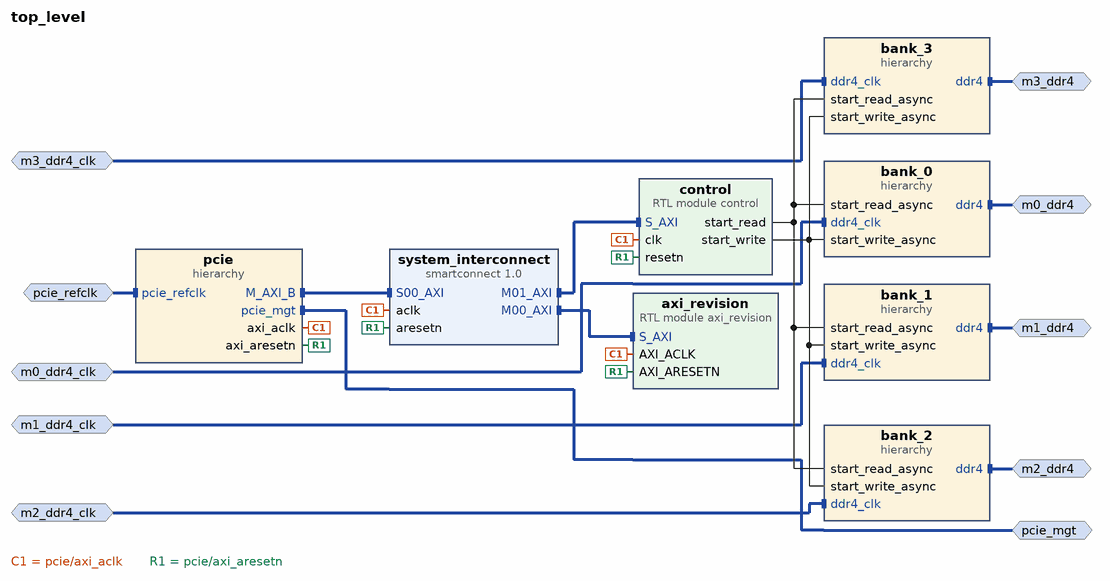
[diagram p0: block diagram of the top level]
# Vivado block design top_level, xcvu9p-flgb2104-3-e, Vivado 2021.1
create_bd_design top_level

create_bd_intf_port -mode Slave -vlnv xilinx.com:interface:diff_clock_rtl:1.0 pcie_refclk
create_bd_intf_port -mode Master -vlnv xilinx.com:interface:pcie_7x_mgt_rtl:1.0 pcie_mgt
create_bd_intf_port -mode Slave -vlnv xilinx.com:interface:diff_clock_rtl:1.0 m0_ddr4_clk
create_bd_intf_port -mode Master -vlnv xilinx.com:interface:ddr4_rtl:1.0 m0_ddr4
create_bd_intf_port -mode Master -vlnv xilinx.com:interface:ddr4_rtl:1.0 m1_ddr4
create_bd_intf_port -mode Master -vlnv xilinx.com:interface:ddr4_rtl:1.0 m2_ddr4
create_bd_intf_port -mode Master -vlnv xilinx.com:interface:ddr4_rtl:1.0 m3_ddr4
create_bd_intf_port -mode Slave -vlnv xilinx.com:interface:diff_clock_rtl:1.0 m1_ddr4_clk
create_bd_intf_port -mode Slave -vlnv xilinx.com:interface:diff_clock_rtl:1.0 m2_ddr4_clk
create_bd_intf_port -mode Slave -vlnv xilinx.com:interface:diff_clock_rtl:1.0 m3_ddr4_clk

create_bd_cell -type hier pcie
create_bd_cell -type module -reference axi_revision axi_revision
create_bd_cell -type ip -vlnv xilinx.com:ip:smartconnect:1.0 system_interconnect
set_property -dict {CONFIG.NUM_MI 2 CONFIG.NUM_SI 1} [get_bd_cells system_interconnect]
create_bd_cell -type hier bank_0
create_bd_cell -type module -reference control control
create_bd_cell -type hier bank_1
create_bd_cell -type hier bank_2
create_bd_cell -type hier bank_3

# ---- hierarchy /pcie ----
current_bd_instance /pcie
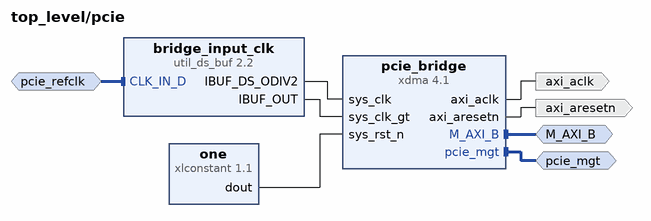
[diagram p1: block diagram inside /pcie]
create_bd_intf_pin -mode Master -vlnv xilinx.com:interface:pcie_7x_mgt_rtl:1.0 pcie_mgt
create_bd_intf_pin -mode Slave -vlnv xilinx.com:interface:diff_clock_rtl:1.0 pcie_refclk
create_bd_intf_pin -mode Master -vlnv xilinx.com:interface:aximm_rtl:1.0 M_AXI_B
create_bd_pin -dir O -type clk axi_aclk
create_bd_pin -dir O -type rst axi_aresetn

create_bd_cell -type ip -vlnv xilinx.com:ip:util_ds_buf:2.2 bridge_input_clk
set_property -dict {CONFIG.C_BUF_TYPE IBUFDSGTE} [get_bd_cells bridge_input_clk]
create_bd_cell -type ip -vlnv xilinx.com:ip:xdma:4.1 pcie_bridge
set_property -dict [list \
  CONFIG.PF0_DEVICE_ID_mqdma 903F \
  CONFIG.PF0_SRIOV_VF_DEVICE_ID A03F \
  CONFIG.PF2_DEVICE_ID_mqdma 923F \
  CONFIG.PF3_DEVICE_ID_mqdma 933F \
  CONFIG.axi_addr_width 64 \
  CONFIG.axi_data_width 512_bit \
  CONFIG.axisten_freq 250 \
  CONFIG.bridge_burst true \
  CONFIG.en_axi_master_if true \
  CONFIG.en_axi_slave_if true \
  CONFIG.functional_mode AXI_Bridge \
  CONFIG.mode_selection Advanced \
  CONFIG.pcie_blk_locn X1Y2 \
  CONFIG.pf0_bar0_scale Megabytes \
  CONFIG.pf0_bar0_size 1 \
  CONFIG.pf0_bar1_enabled true \
  CONFIG.pf0_bar1_scale Megabytes \
  CONFIG.pf0_bar1_size 1 \
  CONFIG.pf0_device_id 903F \
  CONFIG.pl_link_cap_max_link_speed 8.0_GT/s \
  CONFIG.pl_link_cap_max_link_width X16 \
  CONFIG.plltype QPLL1 \
] [get_bd_cells pcie_bridge]
create_bd_cell -type ip -vlnv xilinx.com:ip:xlconstant:1.1 one

# ---- hierarchy /bank_0 ----
current_bd_instance /bank_0
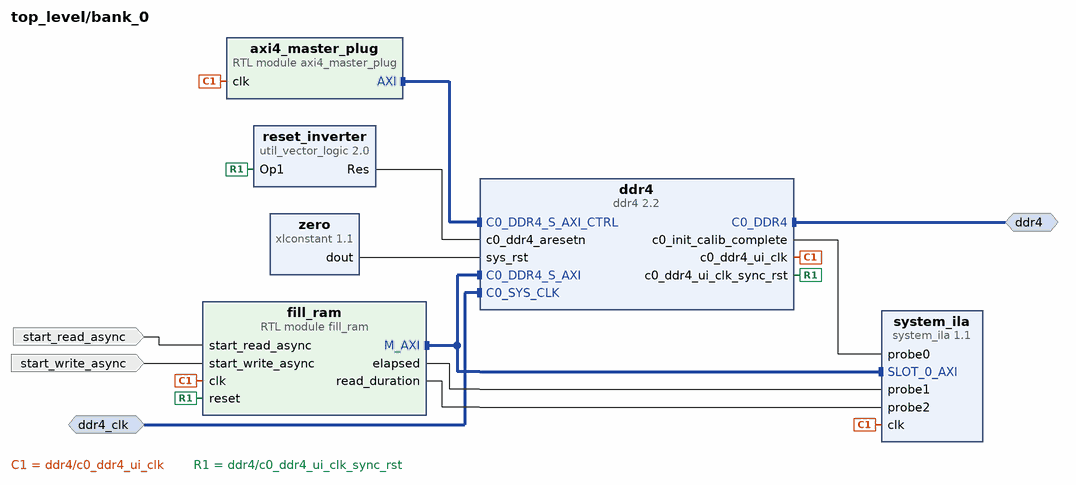
[diagram p2: block diagram inside /bank_0]
create_bd_intf_pin -mode Slave -vlnv xilinx.com:interface:diff_clock_rtl:1.0 ddr4_clk
create_bd_intf_pin -mode Master -vlnv xilinx.com:interface:ddr4_rtl:1.0 ddr4
create_bd_pin -dir I start_write_async
create_bd_pin -dir I start_read_async

create_bd_cell -type module -reference axi4_master_plug axi4_master_plug
create_bd_cell -type ip -vlnv xilinx.com:ip:system_ila:1.1 system_ila
set_property -dict {CONFIG.C_DATA_DEPTH 2048 CONFIG.C_MON_TYPE MIX CONFIG.C_NUM_OF_PROBES 3} [get_bd_cells system_ila]
create_bd_cell -type ip -vlnv xilinx.com:ip:xlconstant:1.1 zero
set_property -dict {CONFIG.CONST_VAL 0} [get_bd_cells zero]
create_bd_cell -type ip -vlnv xilinx.com:ip:util_vector_logic:2.0 reset_inverter
set_property -dict {CONFIG.C_OPERATION not CONFIG.C_SIZE 1} [get_bd_cells reset_inverter]
create_bd_cell -type ip -vlnv xilinx.com:ip:ddr4:2.2 ddr4
set_property -dict [list \
  CONFIG.C0.DDR4_AxiAddressWidth 34 \
  CONFIG.C0.DDR4_AxiDataWidth 512 \
  CONFIG.C0.DDR4_CasWriteLatency 16 \
  CONFIG.C0.DDR4_CustomParts ../../../../../../ddr/MTA18ADF2G72PZ-2G3.csv \
  CONFIG.C0.DDR4_DataWidth 72 \
  CONFIG.C0.DDR4_EN_PARITY true \
  CONFIG.C0.DDR4_InputClockPeriod 9996 \
  CONFIG.C0.DDR4_MemoryPart MTA18ADF2G72PZ-2G3 \
  CONFIG.C0.DDR4_MemoryType RDIMMs \
  CONFIG.C0.DDR4_TimePeriod 833 \
  CONFIG.C0.DDR4_isCustom true \
] [get_bd_cells ddr4]
create_bd_cell -type module -reference fill_ram fill_ram

# ---- hierarchy /bank_1 ----
current_bd_instance /bank_1
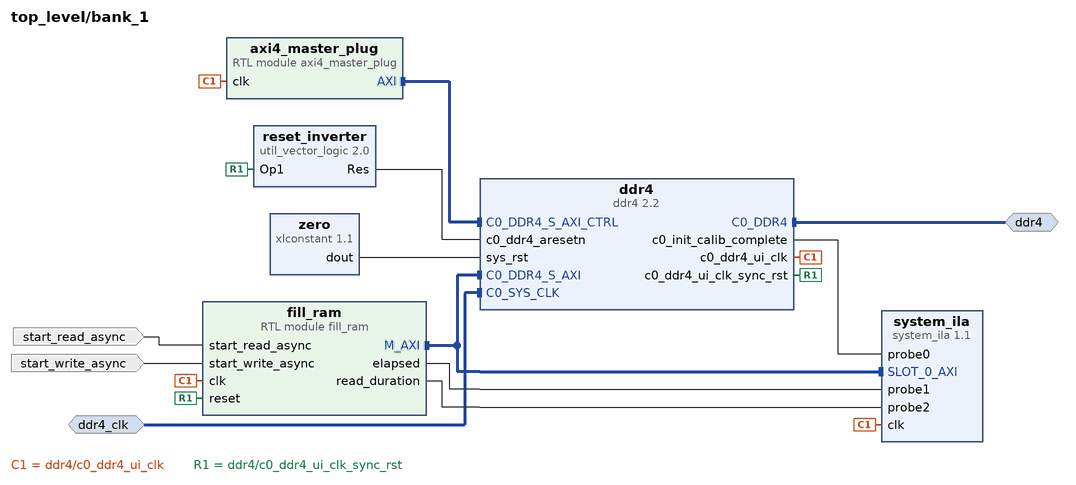
[diagram p3: block diagram inside /bank_1]
create_bd_intf_pin -mode Slave -vlnv xilinx.com:interface:diff_clock_rtl:1.0 ddr4_clk
create_bd_intf_pin -mode Master -vlnv xilinx.com:interface:ddr4_rtl:1.0 ddr4
create_bd_pin -dir I start_write_async
create_bd_pin -dir I start_read_async

create_bd_cell -type module -reference axi4_master_plug axi4_master_plug
create_bd_cell -type ip -vlnv xilinx.com:ip:system_ila:1.1 system_ila
set_property -dict {CONFIG.C_DATA_DEPTH 2048 CONFIG.C_MON_TYPE MIX CONFIG.C_NUM_OF_PROBES 3} [get_bd_cells system_ila]
create_bd_cell -type ip -vlnv xilinx.com:ip:xlconstant:1.1 zero
set_property -dict {CONFIG.CONST_VAL 0} [get_bd_cells zero]
create_bd_cell -type ip -vlnv xilinx.com:ip:util_vector_logic:2.0 reset_inverter
set_property -dict {CONFIG.C_OPERATION not CONFIG.C_SIZE 1} [get_bd_cells reset_inverter]
create_bd_cell -type ip -vlnv xilinx.com:ip:ddr4:2.2 ddr4
set_property -dict [list \
  CONFIG.C0.DDR4_AxiAddressWidth 34 \
  CONFIG.C0.DDR4_AxiDataWidth 512 \
  CONFIG.C0.DDR4_CasWriteLatency 16 \
  CONFIG.C0.DDR4_CustomParts ../../../../../../ddr/MTA18ADF2G72PZ-2G3.csv \
  CONFIG.C0.DDR4_DataWidth 72 \
  CONFIG.C0.DDR4_EN_PARITY true \
  CONFIG.C0.DDR4_InputClockPeriod 9996 \
  CONFIG.C0.DDR4_MemoryPart MTA18ADF2G72PZ-2G3 \
  CONFIG.C0.DDR4_MemoryType RDIMMs \
  CONFIG.C0.DDR4_TimePeriod 833 \
  CONFIG.C0.DDR4_isCustom true \
] [get_bd_cells ddr4]
create_bd_cell -type module -reference fill_ram fill_ram
set_property -dict {CONFIG.CHANNEL 1} [get_bd_cells fill_ram]

# ---- hierarchy /bank_2 ----
current_bd_instance /bank_2
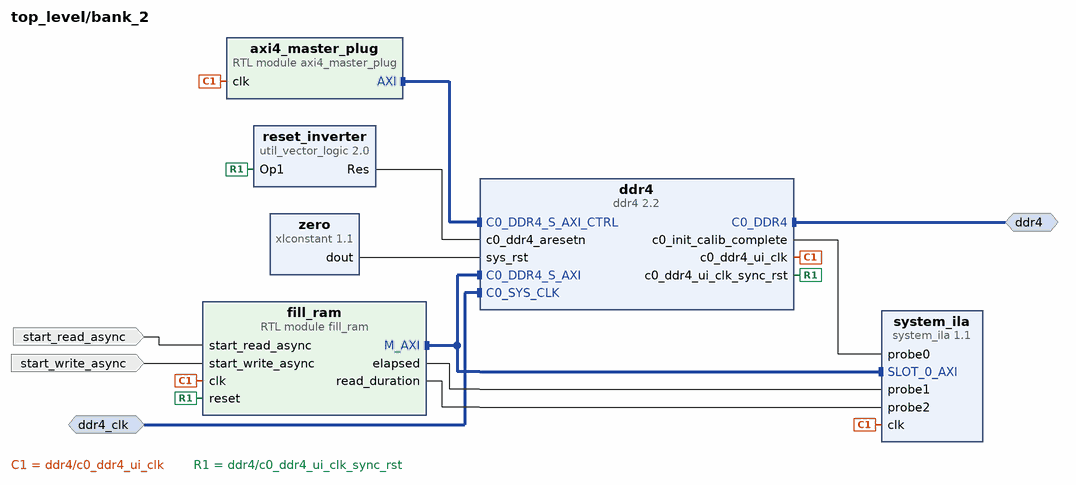
[diagram p4: block diagram inside /bank_2]
create_bd_intf_pin -mode Slave -vlnv xilinx.com:interface:diff_clock_rtl:1.0 ddr4_clk
create_bd_intf_pin -mode Master -vlnv xilinx.com:interface:ddr4_rtl:1.0 ddr4
create_bd_pin -dir I start_write_async
create_bd_pin -dir I start_read_async

create_bd_cell -type module -reference axi4_master_plug axi4_master_plug
create_bd_cell -type ip -vlnv xilinx.com:ip:system_ila:1.1 system_ila
set_property -dict {CONFIG.C_DATA_DEPTH 2048 CONFIG.C_MON_TYPE MIX CONFIG.C_NUM_OF_PROBES 3} [get_bd_cells system_ila]
create_bd_cell -type ip -vlnv xilinx.com:ip:xlconstant:1.1 zero
set_property -dict {CONFIG.CONST_VAL 0} [get_bd_cells zero]
create_bd_cell -type ip -vlnv xilinx.com:ip:util_vector_logic:2.0 reset_inverter
set_property -dict {CONFIG.C_OPERATION not CONFIG.C_SIZE 1} [get_bd_cells reset_inverter]
create_bd_cell -type ip -vlnv xilinx.com:ip:ddr4:2.2 ddr4
set_property -dict [list \
  CONFIG.C0.DDR4_AxiAddressWidth 34 \
  CONFIG.C0.DDR4_AxiDataWidth 512 \
  CONFIG.C0.DDR4_CasWriteLatency 16 \
  CONFIG.C0.DDR4_CustomParts ../../../../../../ddr/MTA18ADF2G72PZ-2G3.csv \
  CONFIG.C0.DDR4_DataWidth 72 \
  CONFIG.C0.DDR4_EN_PARITY true \
  CONFIG.C0.DDR4_InputClockPeriod 9996 \
  CONFIG.C0.DDR4_MemoryPart MTA18ADF2G72PZ-2G3 \
  CONFIG.C0.DDR4_MemoryType RDIMMs \
  CONFIG.C0.DDR4_TimePeriod 833 \
  CONFIG.C0.DDR4_isCustom true \
] [get_bd_cells ddr4]
create_bd_cell -type module -reference fill_ram fill_ram
set_property -dict {CONFIG.CHANNEL 3} [get_bd_cells fill_ram]

# ---- hierarchy /bank_3 ----
current_bd_instance /bank_3
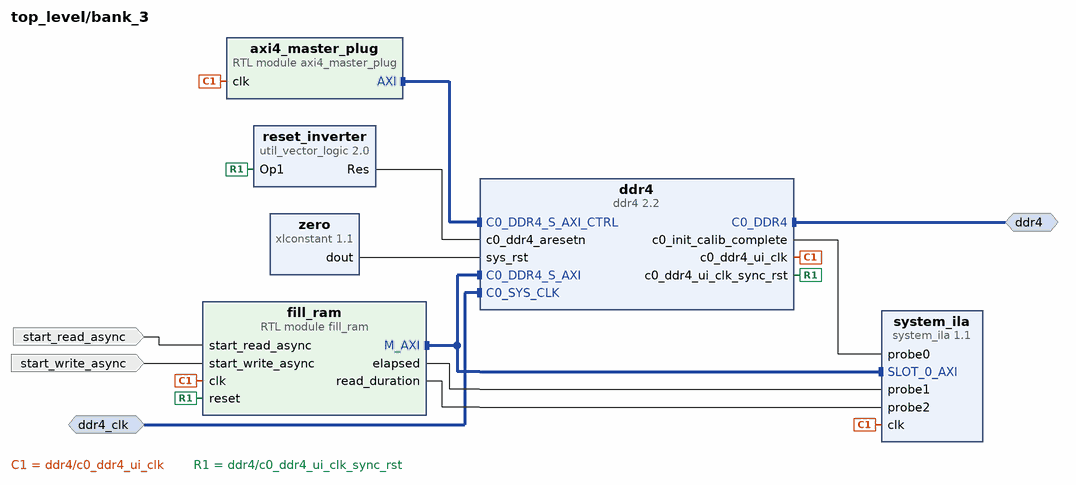
[diagram p5: block diagram inside /bank_3]
create_bd_intf_pin -mode Slave -vlnv xilinx.com:interface:diff_clock_rtl:1.0 ddr4_clk
create_bd_intf_pin -mode Master -vlnv xilinx.com:interface:ddr4_rtl:1.0 ddr4
create_bd_pin -dir I start_write_async
create_bd_pin -dir I start_read_async

create_bd_cell -type module -reference axi4_master_plug axi4_master_plug
create_bd_cell -type ip -vlnv xilinx.com:ip:system_ila:1.1 system_ila
set_property -dict {CONFIG.C_DATA_DEPTH 2048 CONFIG.C_MON_TYPE MIX CONFIG.C_NUM_OF_PROBES 3} [get_bd_cells system_ila]
create_bd_cell -type ip -vlnv xilinx.com:ip:xlconstant:1.1 zero
set_property -dict {CONFIG.CONST_VAL 0} [get_bd_cells zero]
create_bd_cell -type ip -vlnv xilinx.com:ip:util_vector_logic:2.0 reset_inverter
set_property -dict {CONFIG.C_OPERATION not CONFIG.C_SIZE 1} [get_bd_cells reset_inverter]
create_bd_cell -type ip -vlnv xilinx.com:ip:ddr4:2.2 ddr4
set_property -dict [list \
  CONFIG.C0.DDR4_AxiAddressWidth 34 \
  CONFIG.C0.DDR4_AxiDataWidth 512 \
  CONFIG.C0.DDR4_CasWriteLatency 16 \
  CONFIG.C0.DDR4_CustomParts ../../../../../../ddr/MTA18ADF2G72PZ-2G3.csv \
  CONFIG.C0.DDR4_DataWidth 72 \
  CONFIG.C0.DDR4_EN_PARITY true \
  CONFIG.C0.DDR4_InputClockPeriod 9996 \
  CONFIG.C0.DDR4_MemoryPart MTA18ADF2G72PZ-2G3 \
  CONFIG.C0.DDR4_MemoryType RDIMMs \
  CONFIG.C0.DDR4_TimePeriod 833 \
  CONFIG.C0.DDR4_isCustom true \
] [get_bd_cells ddr4]
create_bd_cell -type module -reference fill_ram fill_ram
set_property -dict {CONFIG.CHANNEL 3} [get_bd_cells fill_ram]

# ---- connections ----

current_bd_instance /pcie
connect_bd_intf_net [get_bd_intf_pins pcie_refclk] [get_bd_intf_pins bridge_input_clk/CLK_IN_D]
connect_bd_intf_net [get_bd_intf_pins M_AXI_B] [get_bd_intf_pins pcie_bridge/M_AXI_B]
connect_bd_intf_net [get_bd_intf_pins pcie_mgt] [get_bd_intf_pins pcie_bridge/pcie_mgt]
connect_bd_net [get_bd_pins one/dout] [get_bd_pins pcie_bridge/sys_rst_n]
connect_bd_net [get_bd_pins pcie_bridge/axi_aclk] [get_bd_pins axi_aclk]
connect_bd_net [get_bd_pins pcie_bridge/axi_aresetn] [get_bd_pins axi_aresetn]
connect_bd_net -net util_ds_buf_0_IBUF_DS_ODIV2 [get_bd_pins bridge_input_clk/IBUF_DS_ODIV2] [get_bd_pins pcie_bridge/sys_clk]
connect_bd_net -net util_ds_buf_0_IBUF_OUT [get_bd_pins bridge_input_clk/IBUF_OUT] [get_bd_pins pcie_bridge/sys_clk_gt]

current_bd_instance /bank_0
connect_bd_intf_net [get_bd_intf_pins ddr4_clk] [get_bd_intf_pins ddr4/C0_SYS_CLK]
connect_bd_intf_net [get_bd_intf_pins axi4_master_plug/AXI] [get_bd_intf_pins ddr4/C0_DDR4_S_AXI_CTRL]
connect_bd_intf_net [get_bd_intf_pins ddr4] [get_bd_intf_pins ddr4/C0_DDR4]
connect_bd_intf_net [get_bd_intf_pins fill_ram/M_AXI] [get_bd_intf_pins ddr4/C0_DDR4_S_AXI]
connect_bd_intf_net [get_bd_intf_pins fill_ram/M_AXI] [get_bd_intf_pins system_ila/SLOT_0_AXI]
connect_bd_net -net ddr4_0_c0_ddr4_ui_clk [get_bd_pins ddr4/c0_ddr4_ui_clk] \
  [get_bd_pins system_ila/clk] [get_bd_pins axi4_master_plug/clk] [get_bd_pins fill_ram/clk]
connect_bd_net -net ddr4_0_c0_ddr4_ui_clk_sync_rst [get_bd_pins ddr4/c0_ddr4_ui_clk_sync_rst] \
  [get_bd_pins reset_inverter/Op1] [get_bd_pins fill_ram/reset]
connect_bd_net -net ddr4_0_c0_init_calib_complete [get_bd_pins ddr4/c0_init_calib_complete] [get_bd_pins system_ila/probe0]
connect_bd_net -net fill_ram_0_elapsed [get_bd_pins fill_ram/elapsed] [get_bd_pins system_ila/probe1]
connect_bd_net [get_bd_pins fill_ram/read_duration] [get_bd_pins system_ila/probe2]
connect_bd_net [get_bd_pins reset_inverter/Res] [get_bd_pins ddr4/c0_ddr4_aresetn]
connect_bd_net [get_bd_pins start_read_async] [get_bd_pins fill_ram/start_read_async]
connect_bd_net [get_bd_pins start_write_async] [get_bd_pins fill_ram/start_write_async]
connect_bd_net [get_bd_pins zero/dout] [get_bd_pins ddr4/sys_rst]

current_bd_instance /bank_1
connect_bd_intf_net [get_bd_intf_pins ddr4_clk] [get_bd_intf_pins ddr4/C0_SYS_CLK]
connect_bd_intf_net [get_bd_intf_pins axi4_master_plug/AXI] [get_bd_intf_pins ddr4/C0_DDR4_S_AXI_CTRL]
connect_bd_intf_net [get_bd_intf_pins ddr4] [get_bd_intf_pins ddr4/C0_DDR4]
connect_bd_intf_net [get_bd_intf_pins fill_ram/M_AXI] [get_bd_intf_pins ddr4/C0_DDR4_S_AXI]
connect_bd_intf_net [get_bd_intf_pins fill_ram/M_AXI] [get_bd_intf_pins system_ila/SLOT_0_AXI]
connect_bd_net -net ddr4_0_c0_ddr4_ui_clk [get_bd_pins ddr4/c0_ddr4_ui_clk] \
  [get_bd_pins system_ila/clk] [get_bd_pins axi4_master_plug/clk] [get_bd_pins fill_ram/clk]
connect_bd_net -net ddr4_0_c0_ddr4_ui_clk_sync_rst [get_bd_pins ddr4/c0_ddr4_ui_clk_sync_rst] \
  [get_bd_pins reset_inverter/Op1] [get_bd_pins fill_ram/reset]
connect_bd_net -net ddr4_0_c0_init_calib_complete [get_bd_pins ddr4/c0_init_calib_complete] [get_bd_pins system_ila/probe0]
connect_bd_net -net fill_ram_0_elapsed [get_bd_pins fill_ram/elapsed] [get_bd_pins system_ila/probe1]
connect_bd_net [get_bd_pins fill_ram/read_duration] [get_bd_pins system_ila/probe2]
connect_bd_net [get_bd_pins reset_inverter/Res] [get_bd_pins ddr4/c0_ddr4_aresetn]
connect_bd_net [get_bd_pins start_read_async] [get_bd_pins fill_ram/start_read_async]
connect_bd_net [get_bd_pins start_write_async] [get_bd_pins fill_ram/start_write_async]
connect_bd_net [get_bd_pins zero/dout] [get_bd_pins ddr4/sys_rst]

current_bd_instance /bank_2
connect_bd_intf_net [get_bd_intf_pins ddr4_clk] [get_bd_intf_pins ddr4/C0_SYS_CLK]
connect_bd_intf_net [get_bd_intf_pins axi4_master_plug/AXI] [get_bd_intf_pins ddr4/C0_DDR4_S_AXI_CTRL]
connect_bd_intf_net [get_bd_intf_pins ddr4] [get_bd_intf_pins ddr4/C0_DDR4]
connect_bd_intf_net [get_bd_intf_pins fill_ram/M_AXI] [get_bd_intf_pins ddr4/C0_DDR4_S_AXI]
connect_bd_intf_net [get_bd_intf_pins fill_ram/M_AXI] [get_bd_intf_pins system_ila/SLOT_0_AXI]
connect_bd_net -net ddr4_0_c0_ddr4_ui_clk [get_bd_pins ddr4/c0_ddr4_ui_clk] \
  [get_bd_pins system_ila/clk] [get_bd_pins axi4_master_plug/clk] [get_bd_pins fill_ram/clk]
connect_bd_net -net ddr4_0_c0_ddr4_ui_clk_sync_rst [get_bd_pins ddr4/c0_ddr4_ui_clk_sync_rst] \
  [get_bd_pins reset_inverter/Op1] [get_bd_pins fill_ram/reset]
connect_bd_net -net ddr4_0_c0_init_calib_complete [get_bd_pins ddr4/c0_init_calib_complete] [get_bd_pins system_ila/probe0]
connect_bd_net -net fill_ram_0_elapsed [get_bd_pins fill_ram/elapsed] [get_bd_pins system_ila/probe1]
connect_bd_net [get_bd_pins fill_ram/read_duration] [get_bd_pins system_ila/probe2]
connect_bd_net [get_bd_pins reset_inverter/Res] [get_bd_pins ddr4/c0_ddr4_aresetn]
connect_bd_net [get_bd_pins start_read_async] [get_bd_pins fill_ram/start_read_async]
connect_bd_net [get_bd_pins start_write_async] [get_bd_pins fill_ram/start_write_async]
connect_bd_net [get_bd_pins zero/dout] [get_bd_pins ddr4/sys_rst]

current_bd_instance /bank_3
connect_bd_intf_net [get_bd_intf_pins ddr4_clk] [get_bd_intf_pins ddr4/C0_SYS_CLK]
connect_bd_intf_net [get_bd_intf_pins axi4_master_plug/AXI] [get_bd_intf_pins ddr4/C0_DDR4_S_AXI_CTRL]
connect_bd_intf_net [get_bd_intf_pins ddr4] [get_bd_intf_pins ddr4/C0_DDR4]
connect_bd_intf_net [get_bd_intf_pins fill_ram/M_AXI] [get_bd_intf_pins ddr4/C0_DDR4_S_AXI]
connect_bd_intf_net [get_bd_intf_pins fill_ram/M_AXI] [get_bd_intf_pins system_ila/SLOT_0_AXI]
connect_bd_net -net ddr4_0_c0_ddr4_ui_clk [get_bd_pins ddr4/c0_ddr4_ui_clk] \
  [get_bd_pins system_ila/clk] [get_bd_pins axi4_master_plug/clk] [get_bd_pins fill_ram/clk]
connect_bd_net -net ddr4_0_c0_ddr4_ui_clk_sync_rst [get_bd_pins ddr4/c0_ddr4_ui_clk_sync_rst] \
  [get_bd_pins reset_inverter/Op1] [get_bd_pins fill_ram/reset]
connect_bd_net -net ddr4_0_c0_init_calib_complete [get_bd_pins ddr4/c0_init_calib_complete] [get_bd_pins system_ila/probe0]
connect_bd_net -net fill_ram_0_elapsed [get_bd_pins fill_ram/elapsed] [get_bd_pins system_ila/probe1]
connect_bd_net [get_bd_pins fill_ram/read_duration] [get_bd_pins system_ila/probe2]
connect_bd_net [get_bd_pins reset_inverter/Res] [get_bd_pins ddr4/c0_ddr4_aresetn]
connect_bd_net [get_bd_pins start_read_async] [get_bd_pins fill_ram/start_read_async]
connect_bd_net [get_bd_pins start_write_async] [get_bd_pins fill_ram/start_write_async]
connect_bd_net [get_bd_pins zero/dout] [get_bd_pins ddr4/sys_rst]

current_bd_instance /
connect_bd_intf_net [get_bd_intf_ports m0_ddr4_clk] [get_bd_intf_pins bank_0/ddr4_clk]
connect_bd_intf_net [get_bd_intf_ports pcie_refclk] [get_bd_intf_pins pcie/pcie_refclk]
connect_bd_intf_net [get_bd_intf_ports m1_ddr4] [get_bd_intf_pins bank_1/ddr4]
connect_bd_intf_net [get_bd_intf_ports m2_ddr4] [get_bd_intf_pins bank_2/ddr4]
connect_bd_intf_net [get_bd_intf_ports m3_ddr4] [get_bd_intf_pins bank_3/ddr4]
connect_bd_intf_net [get_bd_intf_ports m0_ddr4] [get_bd_intf_pins bank_0/ddr4]
connect_bd_intf_net [get_bd_intf_ports m1_ddr4_clk] [get_bd_intf_pins bank_1/ddr4_clk]
connect_bd_intf_net [get_bd_intf_ports m2_ddr4_clk] [get_bd_intf_pins bank_2/ddr4_clk]
connect_bd_intf_net [get_bd_intf_ports m3_ddr4_clk] [get_bd_intf_pins bank_3/ddr4_clk]
connect_bd_intf_net [get_bd_intf_pins system_interconnect/S00_AXI] [get_bd_intf_pins pcie/M_AXI_B]
connect_bd_intf_net [get_bd_intf_ports pcie_mgt] [get_bd_intf_pins pcie/pcie_mgt]
connect_bd_intf_net [get_bd_intf_pins axi_revision/S_AXI] [get_bd_intf_pins system_interconnect/M00_AXI]
connect_bd_intf_net [get_bd_intf_pins control/S_AXI] [get_bd_intf_pins system_interconnect/M01_AXI]
connect_bd_net [get_bd_pins control/start_read] \
  [get_bd_pins bank_0/start_read_async] [get_bd_pins bank_1/start_read_async] [get_bd_pins bank_2/start_read_async] \
  [get_bd_pins bank_3/start_read_async]
connect_bd_net [get_bd_pins control/start_write] \
  [get_bd_pins bank_0/start_write_async] [get_bd_pins bank_1/start_write_async] [get_bd_pins bank_2/start_write_async] \
  [get_bd_pins bank_3/start_write_async]
connect_bd_net [get_bd_pins pcie/axi_aclk] [get_bd_pins axi_revision/AXI_ACLK] [get_bd_pins system_interconnect/aclk] [get_bd_pins control/clk]
connect_bd_net [get_bd_pins pcie/axi_aresetn] \
  [get_bd_pins axi_revision/AXI_ARESETN] [get_bd_pins system_interconnect/aresetn] [get_bd_pins control/resetn]

# ---- address map ----
assign_bd_address -offset 0x80000000 -range 1M -target_address_space [get_bd_addr_spaces bank_0/axi4_master_plug/AXI] [get_bd_addr_segs bank_0/ddr4/C0_DDR4_MEMORY_MAP_CTRL/C0_REG]
assign_bd_address -offset 0x0000000000000000 -range 16G -target_address_space [get_bd_addr_spaces bank_0/fill_ram/M_AXI] [get_bd_addr_segs bank_0/ddr4/C0_DDR4_MEMORY_MAP/C0_DDR4_ADDRESS_BLOCK]
assign_bd_address -offset 0x80000000 -range 1M -target_address_space [get_bd_addr_spaces bank_1/axi4_master_plug/AXI] [get_bd_addr_segs bank_1/ddr4/C0_DDR4_MEMORY_MAP_CTRL/C0_REG]
assign_bd_address -offset 0x0000000000000000 -range 16G -target_address_space [get_bd_addr_spaces bank_1/fill_ram/M_AXI] [get_bd_addr_segs bank_1/ddr4/C0_DDR4_MEMORY_MAP/C0_DDR4_ADDRESS_BLOCK]
assign_bd_address -offset 0x80000000 -range 1M -target_address_space [get_bd_addr_spaces bank_2/axi4_master_plug/AXI] [get_bd_addr_segs bank_2/ddr4/C0_DDR4_MEMORY_MAP_CTRL/C0_REG]
assign_bd_address -offset 0x0000000000000000 -range 16G -target_address_space [get_bd_addr_spaces bank_2/fill_ram/M_AXI] [get_bd_addr_segs bank_2/ddr4/C0_DDR4_MEMORY_MAP/C0_DDR4_ADDRESS_BLOCK]
assign_bd_address -offset 0x80000000 -range 1M -target_address_space [get_bd_addr_spaces bank_3/axi4_master_plug/AXI] [get_bd_addr_segs bank_3/ddr4/C0_DDR4_MEMORY_MAP_CTRL/C0_REG]
assign_bd_address -offset 0x0000000000000000 -range 16G -target_address_space [get_bd_addr_spaces bank_3/fill_ram/M_AXI] [get_bd_addr_segs bank_3/ddr4/C0_DDR4_MEMORY_MAP/C0_DDR4_ADDRESS_BLOCK]
assign_bd_address -offset 0x0000000000000000 -range 128 -target_address_space [get_bd_addr_spaces pcie/pcie_bridge/M_AXI_B] [get_bd_addr_segs axi_revision/S_AXI/reg0]
assign_bd_address -offset 0x0000000000001000 -range 128 -target_address_space [get_bd_addr_spaces pcie/pcie_bridge/M_AXI_B] [get_bd_addr_segs control/S_AXI/reg0]

validate_bd_design
save_bd_design
